# Altium schematic sheet eps_digital.SchDoc
size A4
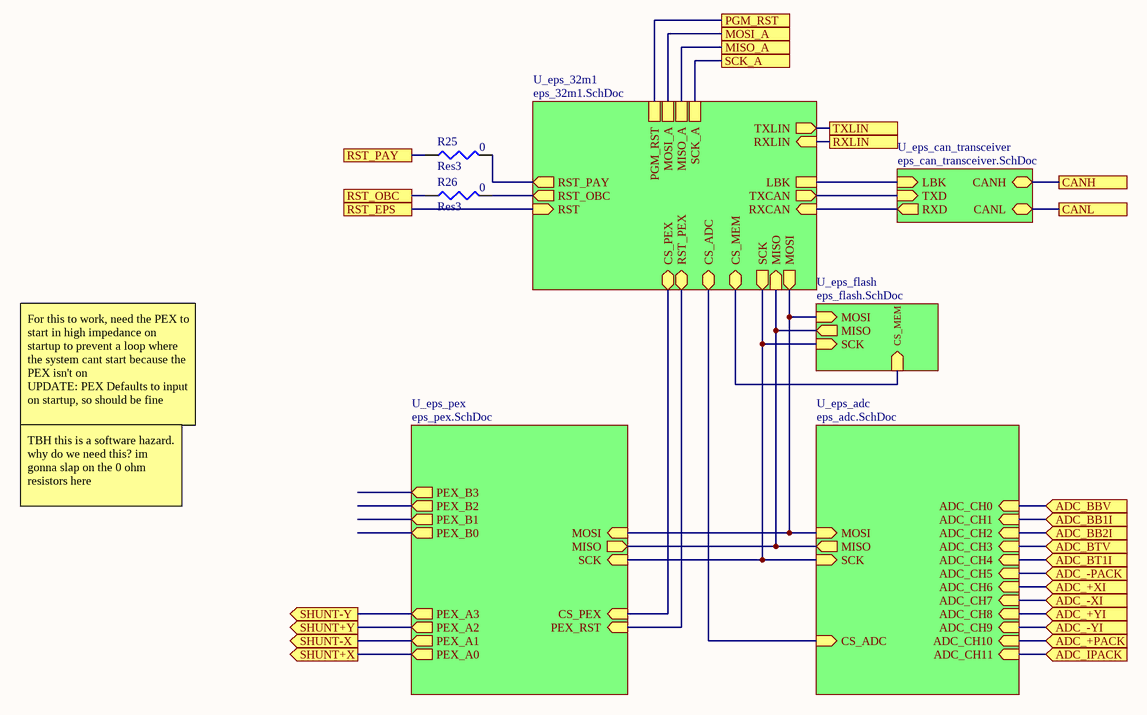
[diagram p0: eps_digital.SchDoc]

## Parts
R25  Res3  value 0  [J1-0603]
R26  Res3  value 0  [J1-0603]

## Sub-sheets
U_eps_32m1 = eps_32m1.SchDoc: MISO (in), SCK (out), TXLIN (out), MOSI (out), TXCAN (out), RXCAN (in), RXLIN (in), RST_OBC (out), RST_PAY (out), RST_PEX (bidir), CS_ADC (bidir), CS_PEX (bidir), CS_MEM (bidir), RST (in), LBK, PGM_RST, MOSI_A, MISO_A, SCK_A
U_eps_adc = eps_adc.SchDoc: ADC_CH10 (in), ADC_CH11 (in), ADC_CH9 (in), ADC_CH5 (in), ADC_CH6 (in), ADC_CH7 (in), ADC_CH3 (in), ADC_CH2 (in), ADC_CH8 (in), ADC_CH4 (in), ADC_CH1 (in), ADC_CH0 (in), MISO (out), MOSI (in), CS_ADC (in), SCK (in)
U_eps_can_transceiver = eps_can_transceiver.SchDoc: RXD (out), TXD (in), LBK (in), CANL (bidir), CANH (bidir)
U_eps_flash = eps_flash.SchDoc: SCK (in), CS_MEM (in), MOSI (in), MISO (out)
U_eps_pex = eps_pex.SchDoc: PEX_B0 (out), PEX_B1 (out), PEX_B2 (out), PEX_B3 (out), PEX_A1 (out), PEX_A2 (out), PEX_A0 (out), PEX_A3 (out), MISO (out), MOSI (in), SCK (in), CS_PEX (in), PEX_RST (in)

## Ports
ADC_+PACK (in), ADC_+XI (in), ADC_+YI (in), ADC_-PACK (in), ADC_-XI (in), ADC_-YI (in), ADC_BB1I (in), ADC_BB2I (in), ADC_BBV (in), ADC_BT1I (in), ADC_BTV (in), ADC_IPACK (in), CANH, CANL, MISO_A, MOSI_A, PGM_RST, RST_EPS, RST_OBC, RST_PAY, RXLIN, SCK_A, SHUNT+X (out), SHUNT+Y (out), SHUNT-X (out), SHUNT-Y (out), TXLIN

## Nets
ADC_+PACK: port ADC_+PACK, sheet U_eps_adc/ADC_CH10
ADC_+XI: port ADC_+XI, sheet U_eps_adc/ADC_CH6
ADC_+YI: port ADC_+YI, sheet U_eps_adc/ADC_CH8
ADC_-PACK: port ADC_-PACK, sheet U_eps_adc/ADC_CH5
ADC_-XI: port ADC_-XI, sheet U_eps_adc/ADC_CH7
ADC_-YI: port ADC_-YI, sheet U_eps_adc/ADC_CH9
ADC_BB1I: port ADC_BB1I, sheet U_eps_adc/ADC_CH1
ADC_BB2I: port ADC_BB2I, sheet U_eps_adc/ADC_CH2
ADC_BBV: port ADC_BBV, sheet U_eps_adc/ADC_CH0
ADC_BT1I: port ADC_BT1I, sheet U_eps_adc/ADC_CH4
ADC_BTV: port ADC_BTV, sheet U_eps_adc/ADC_CH3
ADC_IPACK: port ADC_IPACK, sheet U_eps_adc/ADC_CH11
CANH: port CANH, sheet U_eps_can_transceiver/CANH
CANL: port CANL, sheet U_eps_can_transceiver/CANL
MISO_A: port MISO_A, sheet U_eps_32m1/MISO_A
MOSI_A: port MOSI_A, sheet U_eps_32m1/MOSI_A
PGM_RST: port PGM_RST, sheet U_eps_32m1/PGM_RST
RST_EPS: port RST_EPS, sheet U_eps_32m1/RST
RST_OBC: R26.1 ; port RST_OBC
RST_PAY: R25.1 ; port RST_PAY
RXLIN: port RXLIN, sheet U_eps_32m1/RXLIN
SCK_A: port SCK_A, sheet U_eps_32m1/SCK_A
SHUNT+X: port SHUNT+X, sheet U_eps_pex/PEX_A0
SHUNT+Y: port SHUNT+Y, sheet U_eps_pex/PEX_A2
SHUNT-X: port SHUNT-X, sheet U_eps_pex/PEX_A1
SHUNT-Y: port SHUNT-Y, sheet U_eps_pex/PEX_A3
TXLIN: port TXLIN, sheet U_eps_32m1/TXLIN
NetR25_2: R25.2 ; sheet U_eps_32m1/RST_PAY
NetR26_2: R26.2 ; sheet U_eps_32m1/RST_OBC
(unnamed): sheet U_eps_32m1/MISO, sheet U_eps_flash/MISO, sheet U_eps_pex/MISO, sheet U_eps_adc/MISO
(unnamed): sheet U_eps_32m1/SCK, sheet U_eps_flash/SCK, sheet U_eps_pex/SCK, sheet U_eps_adc/SCK
(unnamed): sheet U_eps_32m1/MOSI, sheet U_eps_flash/MOSI, sheet U_eps_pex/MOSI, sheet U_eps_adc/MOSI
(unnamed): sheet U_eps_32m1/TXCAN, sheet U_eps_can_transceiver/TXD
(unnamed): sheet U_eps_32m1/RXCAN, sheet U_eps_can_transceiver/RXD
(unnamed): sheet U_eps_32m1/RST_PEX, sheet U_eps_pex/PEX_RST
(unnamed): sheet U_eps_32m1/CS_ADC, sheet U_eps_adc/CS_ADC
(unnamed): sheet U_eps_32m1/CS_PEX, sheet U_eps_pex/CS_PEX
(unnamed): sheet U_eps_32m1/CS_MEM, sheet U_eps_flash/CS_MEM
(unnamed): sheet U_eps_32m1/LBK, sheet U_eps_can_transceiver/LBK

## Notes on the sheet
- For this to work, need the PEX to start in high impedance on startup to prevent a loop where the system cant start because the PEX isn't on
  UPDATE: PEX Defaults to input on startup, so should be fine
- TBH this is a software hazard. why do we need this? im gonna slap on the 0 ohm resistors here

## Library data of the parts
R25 R26 = Res3: Resistor; Published: 8-Jun-2000; LatestRevisionDate: 29-May-2009; LatestRevisionNote: IPC-7351 Footprint Added.; PackageReference: J1-0603; Publisher: Altium Limited; PackageDescription: Chip Resistor